# EAGLE schematic SquareSprite (EAGLE 6.6.0)

## Sheet 1 of 2
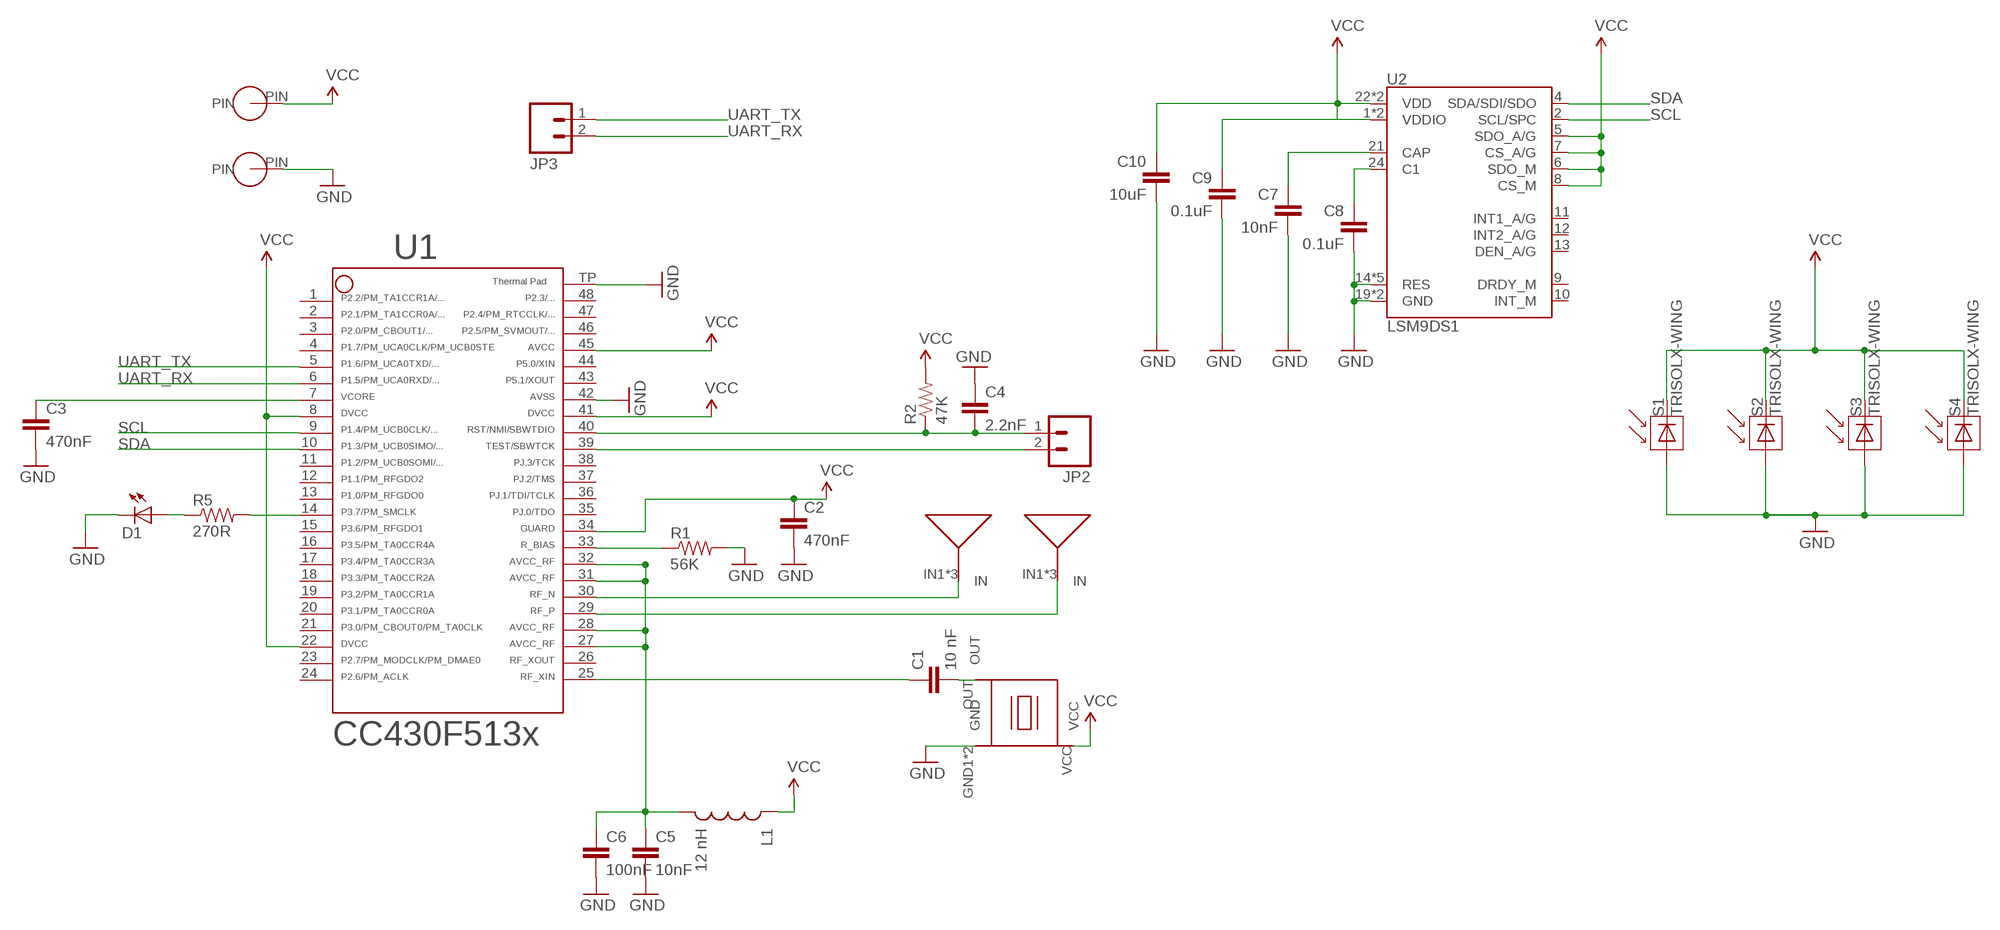
[diagram p0: schematic, sheet 1]

### Parts
ANT-N  ANTENNA  [ANTENNA]
ANT-P  ANTENNA  [ANTENNA]
C1  10 nF  CAP0603-CAP  [0603-CAP]
C2  470nF  CAP0603-CAP  [0603-CAP]
C3  470nF  CAP0603-CAP  [0603-CAP]
C4  2.2nF  CAP0603-CAP  [0603-CAP]
C5  10nF  CAP0603-CAP  [0603-CAP]
C6  100nF  CAP0603-CAP  [0603-CAP]
C7  10nF  CAP0603-CAP  [0603-CAP]
C8  0.1uF  CAP0603-CAP  [0603-CAP]
C9  0.1uF  CAP0603-CAP  [0603-CAP]
C10  10uF  CAP0603-CAP  [0603-CAP]
D1  LED0603  [LED-0603]
JP2  M02PTH  [1X02]
JP3  M02PTH  [1X02]
L1  12 nH  INDUCTOR0603  [0603]
P1  SPRITE_PIN  [SPRITE_PIN]
P2  SPRITE_PIN  [SPRITE_PIN]
R1  56K  RESISTOR0603-RES  [0603-RES]
R2  47K  RESISTOR0603-RES  [0603-RES]
R5  270R  RESISTOR0603-RES  [0603-RES]
S1  TRISOLX-WING  [TRISOLX-T01]
S2  TRISOLX-WING  [TRISOLX-T01]
S3  TRISOLX-WING  [TRISOLX-T01]
S4  TRISOLX-WING  [TRISOLX-T01]
U1  CC430F5137  CC430F513X---RGZ48  [RGZ48]
U2  LSM9DS1  [LGA24-8X4]
X1  TCXO_7Z  [TXC_7Z]

### Nets
GND: C2.2 C3.2 C4.1 C5.2 C6.2 C7.2 C8.2 C9.2 C10.2 D1.C P1.PIN R1.2 S1.P$3(A) S2.P$3(A) S3.P$3(A) S4.P$3(A) U1.42 U1.TP U2.14(RES) U2.15(RES) U2.16(RES) U2.17(RES) U2.18(RES) U2.19(GND) U2.20(GND) X1.GND1(GND) X1.GND2(GND)
N$1: C1.1 U1.25
N$2: R5.2 U1.14
N$3: R1.1 U1.33
N$4: C3.1 U1.7
N$5: C7.1 U2.21(CAP)
N$6: C8.1 U2.24(C1)
N$11: D1.A R5.1
N$12: C1.2 X1.OUT
RFN: ANT-N.IN1(IN) ANT-N.IN2(IN) ANT-N.IN3(IN) U1.30
RFP: ANT-P.IN1(IN) ANT-P.IN2(IN) ANT-P.IN3(IN) U1.29
RST: C4.2 JP2.1 R2.1 U1.40
SCL: U1.9 U2.2(SCL/SPC)
SDA: U1.10 U2.4(SDA/SDI/SDO)
TEST: JP2.2 U1.39
UART_RX: JP3.2 U1.6
UART_TX: JP3.1 U1.5
VCC: C2.1 C9.1 C10.1 L1.1 P2.PIN R2.2 S1.P$2(C) S2.P$2(C) S3.P$2(C) S4.P$2(C) U1.8 U1.22 U1.34 U1.41 U1.45 U2.1(VDDIO) U2.3(VDDIO) U2.5(SDO_A/G) U2.6(SDO_M) U2.7(CS_A/G) U2.8(CS_M) U2.22(VDD) U2.23(VDD) X1.VCC
VCCRF: C5.1 C6.1 L1.2 U1.27 U1.28 U1.31 U1.32
Unconnected: U1.1 U1.2 U1.3 U1.4 U1.11 U1.12 U1.13 U1.15 U1.16 U1.17 U1.18 U1.19 U1.20 U1.21 U1.23 U1.24 U1.26 U1.35 U1.36 U1.37 U1.38 U1.43 U1.44 U1.46 U1.47 U1.48 U2.9(DRDY_M) U2.10(INT_M) U2.11(INT1_A/G) U2.12(INT2_A/G) U2.13(DEN_A/G)

## Sheet 2 of 2

## Library data of the parts
ANT-N ANT-P = SpriteAntenna:ANTENNA
C1-C10 = SparkFun:CAP: Capacitor Standard 0603 ceramic capacitor, and 0.1" leaded capacitor.
D1 = SparkFun:LED: LEDs Standard schematic elements and footprints for 5mm, 3mm, 1206, and 0603 sized LEDs. 5mm - Spark Fun Electronics SKU : COM-00529 (and others)
JP2 JP3 = SparkFun:M02: Header 2 Standard 2-pin 0.1" header. Use with straight break away headers (SKU : PRT-00116), right angle break away headers (PRT-00553), swiss pins (PRT-00743), machine pins (PRT-00117), and female headers (PRT-00115). Molex polarized connector foot print use with SKU : PRT-08233 with associated crimp pins and housings.
L1 = SparkFun:INDUCTOR: Inductors Basic Inductor/Choke - 0603 and 1206. Footprints are not proven and vary greatly between part numbers.
P1 P2 = SpritePin:SPRITE_PIN
R1 R2 R5 = SparkFun:RESISTOR: Resistor Basic schematic elements and footprints for 0603, 1206, and PTH resistors.
S1-S4 = TriSolX_QzQube:TRISOLX-WING
U1 = TI_MSP430_v16:CC430F513X---RGZ48: ***CC430F513X***RGZ48 ** ** Rev 1.0 ** 06/2010 * http://focus.ti.com/docs/prod/folders/print/cc430f5137.html
U2 = LSM9DS1:LSM9DS1: LSM9DS1 3D accelerometer, gyroscope & magnetometer The LSM9DS1 is a system-in-package featuring a 3D digital linear acceleration sensor, a 3D digital angular rate sensor, and a 3D digital magnetic sensor. The LSM9DS1 has a linear acceleration full scale of ±2g/±4g/±8/±16 g, a magnetic field full scale of ±4/±8/±12/±16 gauss and an angular rate of ±245/±500/±2000 dps. The LSM9DS1 includes an I2 C serial bus interface supporting standard and fast mode (100 kHz and 400 kHz) and an SPI serial standard interface. Magnetic, accelerometer and gyroscope sensing can be enabled or set in power-down mode separately for smart power management. The LSM9DS1 is available in a plastic land grid array package (LGA) and it is guaranteed to operate over an extended temperature range from -40 °C to +85 °C.; PROD_ID: IC-12536
X1 = SpriteTCXO:TCXO_7Z